# Altium schematic sheet Top.SchDoc
size A; SheetNumber: 1; SheetTotal: 4
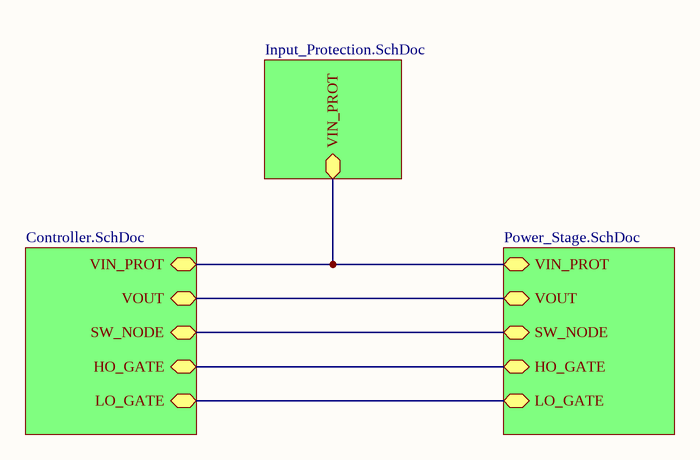
[diagram p0: Top.SchDoc]

## Sub-sheets
? = Input_Protection.SchDoc: VIN_PROT (bidir)
? = Power_Stage.SchDoc: VIN_PROT (bidir), VOUT (bidir), SW_NODE (bidir), HO_GATE (bidir), LO_GATE (bidir)
? = Controller.SchDoc: VIN_PROT (bidir), VOUT (bidir), SW_NODE (bidir), HO_GATE (bidir), LO_GATE (bidir)

## Nets
(unnamed): sheet /VIN_PROT, sheet /VIN_PROT, sheet /VIN_PROT
(unnamed): sheet /VOUT, sheet /VOUT
(unnamed): sheet /SW_NODE, sheet /SW_NODE
(unnamed): sheet /HO_GATE, sheet /HO_GATE
(unnamed): sheet /LO_GATE, sheet /LO_GATE